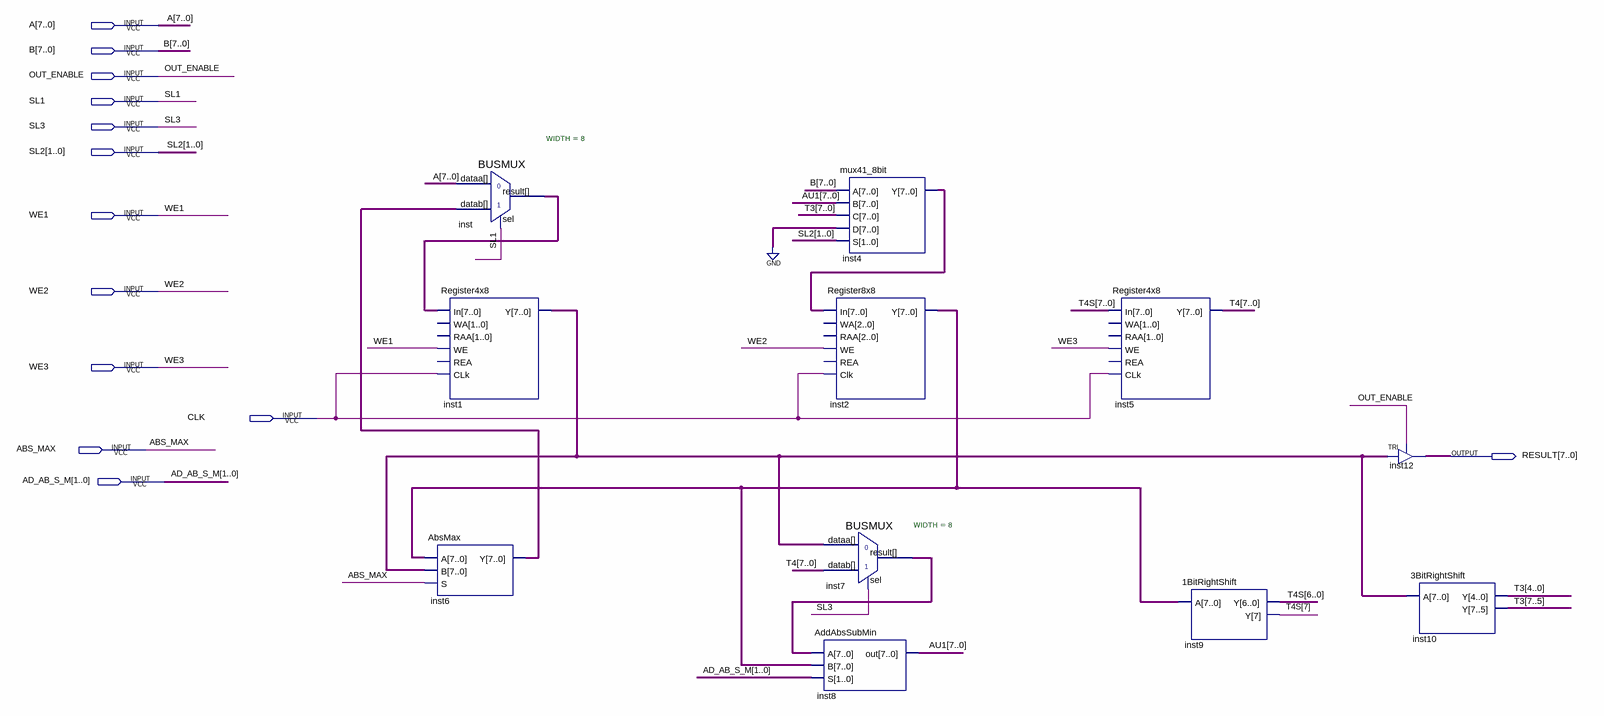
[diagram p0: schematic sheet]
// Quartus schematic sra_.bdf as structural Verilog: 11 symbols, 13 pins
module sra_ (
  input  [7:0] A,
  input  [7:0] B,
  input  OUT_ENABLE,
  input  SL1,
  input  SL3,
  input  [1:0] SL2,
  input  WE1,
  input  WE2,
  input  WE3,
  input  CLK,
  input  ABS_MAX,
  input  [1:0] AD_AB_S_M,
  output [7:0] RESULT
);

  wire [7:0] AU1, inst1_y, inst2_y, inst4_y, inst6_y, inst7_result, inst_result, T3, T4, T4S;

  BUSMUX #(.WIDTH(8)) inst (.datab(inst6_y), .sel(SL1), .dataa(A), .result(inst_result));
  Register4x8 inst1 (.In(inst_result), .WE(WE1), .CLk(CLK), .Y(inst1_y));  // open: WA, RAA, REA
  AbsMax inst6 (.A(inst2_y), .B(inst1_y), .S(ABS_MAX), .Y(inst6_y));
  Register8x8 inst2 (.In(inst4_y), .WE(WE2), .Clk(CLK), .Y(inst2_y));  // open: WA, RAA, REA
  BUSMUX #(.WIDTH(8)) inst7 (.datab(T4), .sel(SL3), .dataa(inst1_y), .result(inst7_result));
  AddAbsSubMin inst8 (.A(inst7_result), .B(inst2_y), .S(AD_AB_S_M), .out(AU1));
  mux41_8bit inst4 (.A(B), .B(AU1), .C(T3), .D({8{1'b0}}), .S(SL2), .Y(inst4_y));
  Register4x8 inst5 (.In(T4S), .WE(WE3), .CLk(CLK), .Y(T4));  // open: WA, RAA, REA
  \1BitRightShift  inst9 (.A(inst2_y), .Y(T4S));
  TRI inst12[7:0] (.IN(inst1_y), .OE(OUT_ENABLE), .OUT(RESULT));
  \3BitRightShift  inst10 (.A(inst1_y), .Y(T3));
endmodule
